# Altium schematic sheet LCD.SchDoc: LCD
size Tabloid; ApprovedBy: NA; CompanyName: Cospan Design LLC; DrawnBy: David McCoy; Engineer: David McCoy; DocumentNumber: 11; Revision: A; SheetNumber: 11; SheetTotal: 18; Client: OSH; Project: Guppy Buddy; ProjectPrettyName: Guppy Buddy
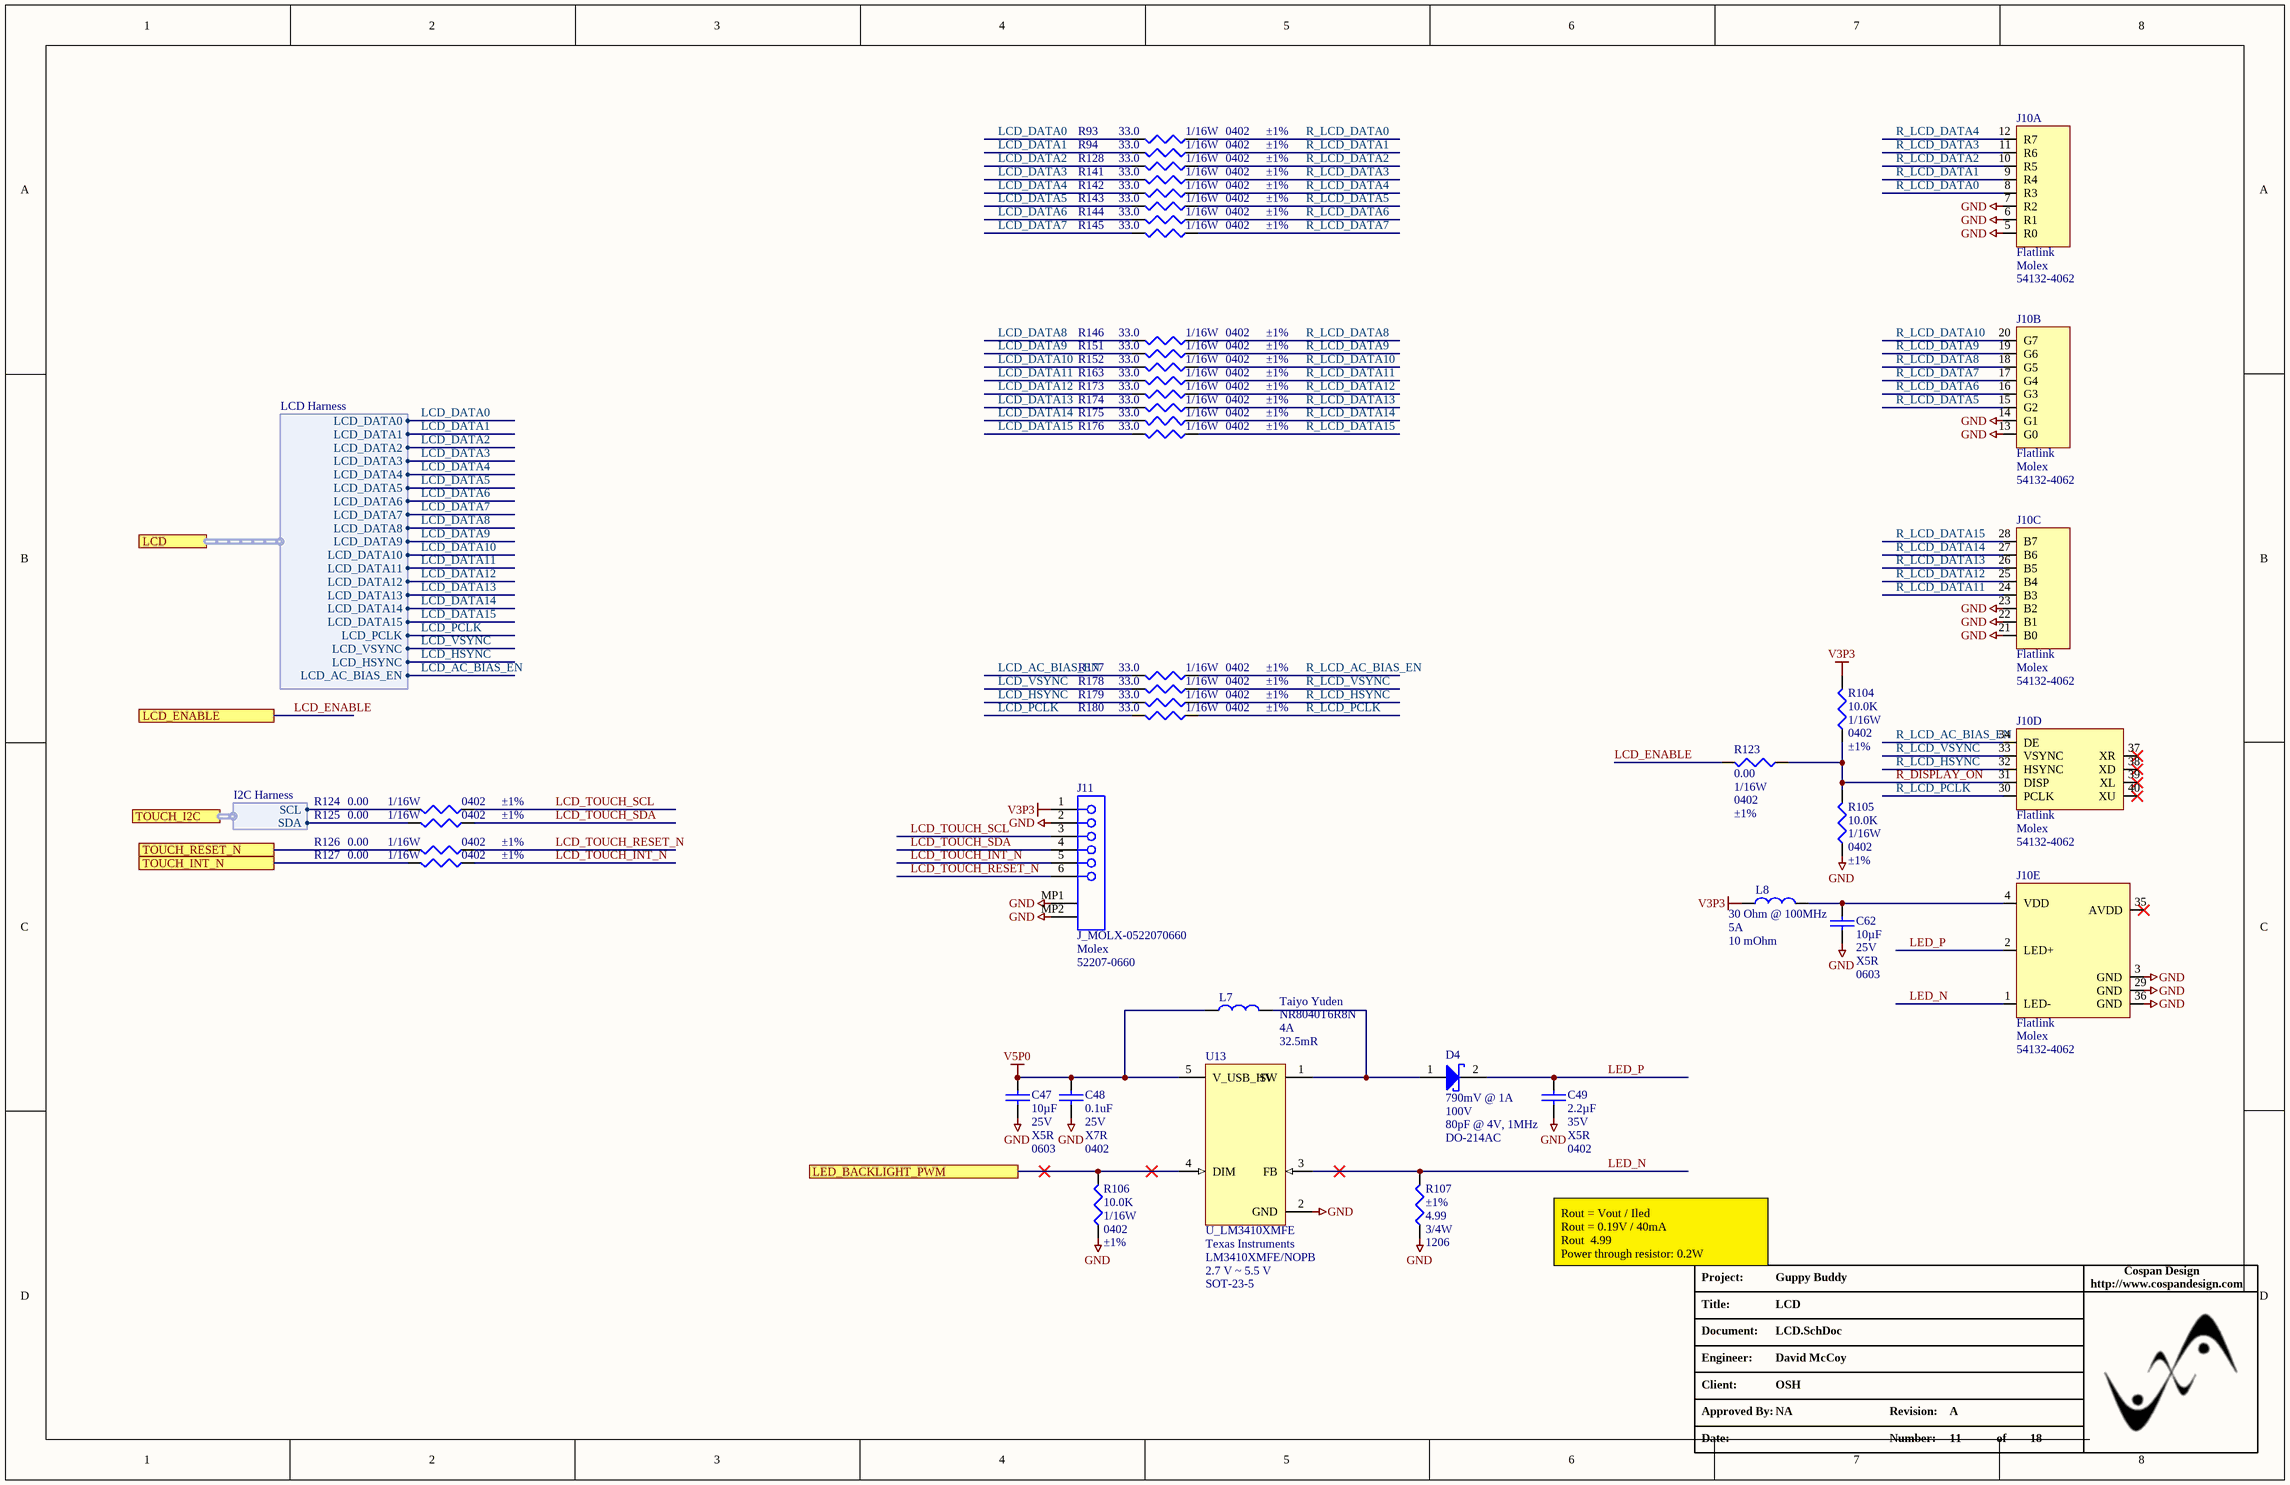
[diagram p0: LCD.SchDoc]

## Parts
C47  Capacitance: 10µF  Voltage - Rated: 25V  Temperature Coefficient: X5R  Package / Case: 0603  [C_ERA-0603]  (hidden comment: C_0603_10µF)
C48  Capacitance: 0.1uF  Voltage - Rated: 25V  Temperature Coefficient: X7R  Package / Case: 0402  [C_0402]  (hidden comment: C_0402_0.1UF_25V)
C49  Capacitance: 2.2µF  Voltage - Rated: 35V  Temperature Coefficient: X5R  Package / Case: 0402  [C_0402]  (hidden comment: C_0402_2.2uF_35V)
C62  Capacitance: 10µF  Voltage - Rated: 25V  Temperature Coefficient: X5R  Package / Case: 0603  [C_ERA-0603]  (hidden comment: C_0603_10µF)
D4  Voltage - Forward (Vf) (Max) @ If: 790mV @ 1A  Voltage - DC Reverse (Vr) (Max): 100V  Capacitance @ Vr, F: 80pF @ 4V, 1MHz  Package / Case: DO-214AC  [DIOM5226X23L]  (hidden comment: B1100-13-F)
J10  Flatlink  Manufacturer 1: Molex  Manufacturer Part Number 1: 54132-4062  [FPC_40PIN_BOTTOM]  (parts A,B,C,D,E of 5)
J11  J_MOLX-0522070660  Manufacturer 1: Molex  Manufacturer Part Number 1: 52207-0660  [MOLX-52271-0679]
L7  Manufacturer: Taiyo Yuden  Manufacturer Part Number: NR8040T6R8N  Max DC Current: 4A  DC Resistance (DCR): 32.5mR  [IND_TAIYO_NR8040]  (hidden comment: L_6.8µH_SHLD_4A)
L8  Impedance @ Frequency: 30 Ohm @ 100MHz  Current Rating (Max): 5A  DC Resistance (DCR) (Max): 10 mOhm  [R_0603]  (hidden comment: L_BEAD_0603_30OHM_100MHZ)
R93  Resistance In Ohms: 33.0  Power (Watts): 1/16W  Case: 0402  Tolerance: ±1%  [R_0402]  (hidden comment: R_0402_33)
R94  Resistance In Ohms: 33.0  Power (Watts): 1/16W  Case: 0402  Tolerance: ±1%  [R_0402]  (hidden comment: R_0402_33)
R104  Resistance In Ohms: 10.0K  Power (Watts): 1/16W  Case: 0402  Tolerance: ±1%  [R_0402]  (hidden comment: R_0402_10.0K)
R105  Resistance In Ohms: 10.0K  Power (Watts): 1/16W  Case: 0402  Tolerance: ±1%  [R_0402]  (hidden comment: R_0402_10.0K)
R106  Resistance In Ohms: 10.0K  Power (Watts): 1/16W  Case: 0402  Tolerance: ±1%  [R_0402]  (hidden comment: R_0402_10.0K)
R107  Tolerance: ±1%  Resistance In Ohms: 4.99  Power (Watts): 3/4W  Case: 1206  [R_1206]  (hidden comment: R_1206_4.99)
R123  Resistance In Ohms: 0.00  Power (Watts): 1/16W  Case: 0402  Tolerance: ±1%  [R_0402]  (hidden comment: 0.0 Ohms)
R124  Resistance In Ohms: 0.00  Power (Watts): 1/16W  Case: 0402  Tolerance: ±1%  [R_0402]  (hidden comment: 0.0 Ohms)
R125  Resistance In Ohms: 0.00  Power (Watts): 1/16W  Case: 0402  Tolerance: ±1%  [R_0402]  (hidden comment: 0.0 Ohms)
R126  Resistance In Ohms: 0.00  Power (Watts): 1/16W  Case: 0402  Tolerance: ±1%  [R_0402]  (hidden comment: 0.0 Ohms)
R127  Resistance In Ohms: 0.00  Power (Watts): 1/16W  Case: 0402  Tolerance: ±1%  [R_0402]  (hidden comment: 0.0 Ohms)
R128  Resistance In Ohms: 33.0  Power (Watts): 1/16W  Case: 0402  Tolerance: ±1%  [R_0402]  (hidden comment: R_0402_33)
R141  Resistance In Ohms: 33.0  Power (Watts): 1/16W  Case: 0402  Tolerance: ±1%  [R_0402]  (hidden comment: R_0402_33)
R142  Resistance In Ohms: 33.0  Power (Watts): 1/16W  Case: 0402  Tolerance: ±1%  [R_0402]  (hidden comment: R_0402_33)
R143  Resistance In Ohms: 33.0  Power (Watts): 1/16W  Case: 0402  Tolerance: ±1%  [R_0402]  (hidden comment: R_0402_33)
R144  Resistance In Ohms: 33.0  Power (Watts): 1/16W  Case: 0402  Tolerance: ±1%  [R_0402]  (hidden comment: R_0402_33)
R145  Resistance In Ohms: 33.0  Power (Watts): 1/16W  Case: 0402  Tolerance: ±1%  [R_0402]  (hidden comment: R_0402_33)
R146  Resistance In Ohms: 33.0  Power (Watts): 1/16W  Case: 0402  Tolerance: ±1%  [R_0402]  (hidden comment: R_0402_33)
R151  Resistance In Ohms: 33.0  Power (Watts): 1/16W  Case: 0402  Tolerance: ±1%  [R_0402]  (hidden comment: R_0402_33)
R152  Resistance In Ohms: 33.0  Power (Watts): 1/16W  Case: 0402  Tolerance: ±1%  [R_0402]  (hidden comment: R_0402_33)
R163  Resistance In Ohms: 33.0  Power (Watts): 1/16W  Case: 0402  Tolerance: ±1%  [R_0402]  (hidden comment: R_0402_33)
R173  Resistance In Ohms: 33.0  Power (Watts): 1/16W  Case: 0402  Tolerance: ±1%  [R_0402]  (hidden comment: R_0402_33)
R174  Resistance In Ohms: 33.0  Power (Watts): 1/16W  Case: 0402  Tolerance: ±1%  [R_0402]  (hidden comment: R_0402_33)
R175  Resistance In Ohms: 33.0  Power (Watts): 1/16W  Case: 0402  Tolerance: ±1%  [R_0402]  (hidden comment: R_0402_33)
R176  Resistance In Ohms: 33.0  Power (Watts): 1/16W  Case: 0402  Tolerance: ±1%  [R_0402]  (hidden comment: R_0402_33)
R177  Resistance In Ohms: 33.0  Power (Watts): 1/16W  Case: 0402  Tolerance: ±1%  [R_0402]  (hidden comment: R_0402_33)
R178  Resistance In Ohms: 33.0  Power (Watts): 1/16W  Case: 0402  Tolerance: ±1%  [R_0402]  (hidden comment: R_0402_33)
R179  Resistance In Ohms: 33.0  Power (Watts): 1/16W  Case: 0402  Tolerance: ±1%  [R_0402]  (hidden comment: R_0402_33)
R180  Resistance In Ohms: 33.0  Power (Watts): 1/16W  Case: 0402  Tolerance: ±1%  [R_0402]  (hidden comment: R_0402_33)
U13  U_LM3410XMFE  Manufacturer: Texas Instruments  Manufacturer Part Number: LM3410XMFE/NOPB  Voltage - Supply: 2.7 V ~ 5.5 V  Supplier Device Package: SOT-23-5  [MF05A_N]

## Ports
LCD (harness LCD Harness), LCD_ENABLE, LED_BACKLIGHT_PWM, TOUCH_I2C (harness I2C Harness), TOUCH_INT_N, TOUCH_RESET_N

## Harnesses
LCD Harness: LCD_DATA0, LCD_DATA1, LCD_DATA2, LCD_DATA3, LCD_DATA4, LCD_DATA5, LCD_DATA6, LCD_DATA7, LCD_DATA8, LCD_DATA9, LCD_DATA10, LCD_DATA11, LCD_DATA12, LCD_DATA13, LCD_DATA14, LCD_DATA15, LCD_PCLK, LCD_VSYNC, LCD_HSYNC, LCD_AC_BIAS_EN
I2C Harness: SCL, SDA

## Nets
GND: C47.1 C48.1 C49.1 C62.1 J10.3(GND) J10.5(R0) J10.6(R1) J10.7(R2) J10.13(G0) J10.14(G1) J10.21(B0) J10.22(B1) J10.23(B2) J10.29(GND) J10.36(GND) J11.2 J11.MP1 J11.MP2 R105.2 R106.2 R107.2 U13.2(GND)
V3P3: J11.1 L8.2 R104.1
V5P0: C47.2 C48.2 L7.1 U13.5(V_USB_HV)
LCD_AC_BIAS_EN: R177.1 ; port LCD.LCD_AC_BIAS_EN
LCD_DATA0: R93.1 ; port LCD.LCD_DATA0
LCD_DATA1: R94.1 ; port LCD.LCD_DATA1
LCD_DATA2: R128.1 ; port LCD.LCD_DATA2
LCD_DATA3: R141.1 ; port LCD.LCD_DATA3
LCD_DATA4: R142.1 ; port LCD.LCD_DATA4
LCD_DATA5: R143.1 ; port LCD.LCD_DATA5
LCD_DATA6: R144.1 ; port LCD.LCD_DATA6
LCD_DATA7: R145.1 ; port LCD.LCD_DATA7
LCD_DATA8: R146.1 ; port LCD.LCD_DATA8
LCD_DATA9: R151.1 ; port LCD.LCD_DATA9
LCD_DATA10: R152.1 ; port LCD.LCD_DATA10
LCD_DATA11: R163.1 ; port LCD.LCD_DATA11
LCD_DATA12: R173.1 ; port LCD.LCD_DATA12
LCD_DATA13: R174.1 ; port LCD.LCD_DATA13
LCD_DATA14: R175.1 ; port LCD.LCD_DATA14
LCD_DATA15: R176.1 ; port LCD.LCD_DATA15
LCD_ENABLE: R123.1 ; port LCD_ENABLE
LCD_HSYNC: R179.1 ; port LCD.LCD_HSYNC
LCD_PCLK: R180.1 ; port LCD.LCD_PCLK
LCD_TOUCH_INT_N: J11.5 R127.2
LCD_TOUCH_RESET_N: J11.6 R126.2
LCD_TOUCH_SCL: J11.3 R124.2
LCD_TOUCH_SDA: J11.4 R125.2
LCD_VSYNC: R178.1 ; port LCD.LCD_VSYNC
LED_BACKLIGHT_PWM: R106.1 U13.4(DIM) ; port LED_BACKLIGHT_PWM
LED_N: J10.1(LED-) R107.1 U13.3(FB)
LED_P: C49.2 D4.2(K) J10.2(LED+)
R_DISPLAY_ON: J10.31(DISP) R104.2 R105.1 R123.2
R_LCD_AC_BIAS_EN: J10.34(DE) R177.2
R_LCD_DATA0: J10.8(R3) R93.2
R_LCD_DATA1: J10.9(R4) R94.2
R_LCD_DATA2: J10.10(R5) R128.2
R_LCD_DATA3: J10.11(R6) R141.2
R_LCD_DATA4: J10.12(R7) R142.2
R_LCD_DATA5: J10.15(G2) R143.2
R_LCD_DATA6: J10.16(G3) R144.2
R_LCD_DATA7: J10.17(G4) R145.2
R_LCD_DATA8: J10.18(G5) R146.2
R_LCD_DATA9: J10.19(G6) R151.2
R_LCD_DATA10: J10.20(G7) R152.2
R_LCD_DATA11: J10.24(B3) R163.2
R_LCD_DATA12: J10.25(B4) R173.2
R_LCD_DATA13: J10.26(B5) R174.2
R_LCD_DATA14: J10.27(B6) R175.2
R_LCD_DATA15: J10.28(B7) R176.2
R_LCD_HSYNC: J10.32(HSYNC) R179.2
R_LCD_PCLK: J10.30(PCLK) R180.2
R_LCD_VSYNC: J10.33(VSYNC) R178.2
TOUCH_INT_N: R127.1 ; port TOUCH_INT_N
TOUCH_RESET_N: R126.1 ; port TOUCH_RESET_N
NetC62_2: C62.2 J10.4(VDD) L8.1
NetD4_1: D4.1(A) L7.2 U13.1(SW)
NetR124_1: R124.1 ; port TOUCH_I2C.SCL
NetR125_1: R125.1 ; port TOUCH_I2C.SDA

Not connected (* = marked no-connect by the designer): J10 35(AVDD)* 37(XR)* 38(XD)* 39(XL)* 40(XU)*

## Notes on the sheet
- Rout = Vout / Iled
  Rout = 0.19V / 40mA
  Rout  4.99
  Power through resistor: 0.2W
- Project:
- http://www.cospandesign.com
- Cospan Design
- Document:
- Engineer:
- Title:
- Client:
- Approved By:
- Revision:
- Date:
- Number:
- of

## Library data of the parts
C47 C62 = C_0603_10µF: CAP CER 10UF 16V X5R 0603; Manufacturer: Murata Electronics North America; Manufacturer Part Number: GRM188R61C106MA73D; Tolerance: ±20%; Supplier 1: Digi-Key; RoHS: RoHS Compliant; Category: Capacitors; Stock 1: 450536; Pricing 1: 1=0.35, 10=0.303, 50=0.184, 100=0.1516, 250=0.12124, 500=0.11042, 1000=0.09959 (USD); Packaging: Cut Tape (CT); Mounting Type: Surface Mount, MLCC; Operating Temperature: -55°C ~ 85°C; Applications: General Purpose; Ratings: -; Size / Dimension: 0.063" L x 0.031" W (1.60mm x 0.80mm); Height - Seated (Max): -; Thickness (Max): 0.031" (0.80mm); Lead Spacing: -; Features: -; Lead Style: -; ComponentLink1URL: http://www.murata.com/~/media/webrenewal/support/library/catalog/products/capacitor/mlcc/c02e.pdf; ComponentLink1Description: http://www.murata.com/~/media/webrenewal/support/library/catalog/products/capacitor/mlcc/c02e.pdf; Supplier Part Number 1: 490-7201-1-ND
C48 = C_0402_0.1UF_25V: CAP CER 0.1UF 25V X6S 0402; Manufacturer 1: Yageo; Manufacturer Part Number 1: CC0402KRX7R8BB104; Description 1: Cap Ceramic 0.1uF 25V X7R 10% SMD 0402 125C Paper T/R; Tolerance: 10%; Dissipation Factor: 3.5%; ComponentLink1URL: https://product.tdk.com/info/en/catalog/datasheets/mlcc_commercial_general_en.pdf; ComponentLink1Description: https://product.tdk.com/info/en/catalog/datasheets/mlcc_commercial_general_en.pdf; Supplier 1: Digi-Key; Supplier Part Number 1: 311-2077-1-ND; Stock 1: 0; Pricing 1: 1=0.1, 10=0.048, 100=0.0215, 500=0.01534, 1000=0.01205, 2500=0.01095, 5000=0.01007 (USD); Mount: Surface Mount; Case/Package: 0402; Case Code (Imperial): 0402; Case Code (Metric): 1005; Min Operating Temperature: -55°C; Max Operating Temperature: 125°C; Voltage Rating: 25V; Voltage Rating (DC): 25V; Packaging: Tape and Reel; Dielectric: X7R; Termination: SMD/SMT; Composition: Ceramic; Length: 1mm; Height: 0.5mm; Width: 0.02inch; Thickness: 0.022inch; Depth: 0.5mm; Radiation Hardening: No; Lead Free: Lead Free; Halogen Free: Halogen Free; ComponentLink2URL: https://datasheet.ciiva.com/11464/upy-gphc-x7r-6-3v-to-50v-8-11464889.pdf; ComponentLink2Description: https://datasheet.ciiva.com/11464/upy-gphc-x7r-6-3v-to-50v-8-11464889.pdf; ComponentLink3URL: https://datasheet.ciiva.com/13210/upy-gphc-x7r-6-3v-to-50v-8-12304-13210908.pdf; ComponentLink3Description: https://datasheet.ciiva.com/13210/upy-gphc-x7r-6-3v-to-50v-8-12304-13210908.pdf; ComponentLink4URL: https://datasheet.ciiva.com/17437/upy-gphc-x7r-6-3v-to-50v-8-17437357.pdf; ComponentLink4Description: https://datasheet.ciiva.com/17437/upy-gphc-x7r-6-3v-to-50v-8-17437357.pdf
C49 = C_0402_2.2uF_35V: CAP CER 2.2UF 35V 20% X5R 0402; Manufacturer: TDK Corporation; Manufacturer Part Number: C1005X5R1V225K050BC; Tolerance: ±10%; Supplier 1: Digi-Key; Supplier Part Number 1: 445-9028-1-ND; RoHS: RoHS Compliant; Category: Capacitors; Stock 1: 300469; Packaging: Cut Tape (CT); Mounting Type: Surface Mount, MLCC; Operating Temperature: -55°C ~ 85°C; Applications: General Purpose; Ratings: -; Size / Dimension: 0.039" L x 0.020" W (1.00mm x 0.50mm); Height - Seated (Max): -; Thickness (Max): 0.022" (0.55mm); Lead Spacing: -; Features: Low ESL; Lead Style: -; ComponentLink1URL: https://product.tdk.com/info/en/catalog/datasheets/mlcc_commercial_general_en.pdf; ComponentLink1Description: https://product.tdk.com/info/en/catalog/datasheets/mlcc_commercial_general_en.pdf; Pricing 1: 1=0.36, 10=0.253, 100=0.1518, 500=0.11386, 1000=0.09614, 2500=0.09108, 5000=0.08602 (USD); Part Status: Active; Failure Rate: -
D4 = D_SCHOTT_B1100-13-F: DIODE SCHOTTKY 100V 1A SMA; Manufacturer: Diodes Inc; Speed: Fast Recovery =< 500ns, > 200mA (Io); Current - Reverse Leakage @ Vr: 500µA @ 100V; Supplier 1: Digi-Key; Supplier Part Number 1: B1100-FDICT-ND; Manufacturer Part Number: B1100-13-F; RoHS: RoHS Compliant; Category: Discrete Semiconductor Products; Stock 1: 109264; Pricing: 1=0.57, 10=0.4, 25=0.3288, 100=0.2627, 250=0.1914, 500=0.15544, 1000=0.11948, 2500=0.1073 (USD); Diode Type: Schottky; Current - Average Rectified (Io): 1A; Reverse Recovery Time (trr): -; Mounting Type: Surface Mount; Supplier Device Package: SMA; Packaging: Cut Tape (CT); ComponentLink1URL: http://www.diodes.com/datasheets/ds30018.pdf; ComponentLink1Description: http://www.diodes.com/datasheets/ds30018.pdf; COST_1: *; COST_100: *; COST_1000: *; MANF1: *; MANF1_PN: *; MANF2: *; MANF2_PN: *; MANF3: *; MANF3_PN: *; VENDOR1: *; VENDOR1_PN: *
J10 = J_FPC_MOLEX_40POS: CONN FFC/FPC .50MM 40POS R/A SMD; Description 1: FFC & FPC Connectors 0.5 FPC Hsg AssyBtmW /AuPlt40CktEmbsTpPkg; Contact Resistance: 20mR; Current Rating: 500mA; Voltage Rating: 50V; Number of Positions: 40; Gender: Female; Mating Cycles: 20; Contact Location: Bottom; Stackable: No; Pitch: 0.5mm; ComponentLink1URL: http://www.molex.com/pdm_docs/sd/541324097_sd.pdf; ComponentLink1Description: http://www.molex.com/pdm_docs/sd/541324097_sd.pdf; Stock 1: 18264; Contact Material: Bronze; Contact Plating: Nickel,Gold; Housing Material: Thermoplastic; Colour: Black; Material: Bronze; Min Operating Temperature: -20°C; Max Operating Temperature: 85°C; Package Quantity: 1500; Number of Rows: 1; Packaging: Tape and Reel; Termination: Solder; Number of Contacts: 40; Orientation: Right Angle; Number of Circuits: 40; Radiation Hardening: No; Flammability Rating: UL94 V-0; REACH SVHC: No SVHC; ELV: Compliant; Lead Free: Lead Free; ComponentLink2URL: https://datasheet.ciiva.com/10366/0541324062-ffc-fpc-connectors-10366848.pdf; ComponentLink2Description: https://datasheet.ciiva.com/10366/0541324062-ffc-fpc-connectors-10366848.pdf; ComponentLink3URL: https://datasheet.ciiva.com/5136/0541324062-ffc-fpc-connectors-143955-5136808.pdf; ComponentLink3Description: https://datasheet.ciiva.com/5136/0541324062-ffc-fpc-connectors-143955-5136808.pdf; ComponentLink4URL: https://datasheet.ciiva.com/11745/0900766b80d5d226-11745087.pdf; ComponentLink4Description: https://datasheet.ciiva.com/11745/0900766b80d5d226-11745087.pdf; Supplier 1: Digi-Key; Supplier Part Number 1: WM3436DKR-ND; Pricing 1: 1=2.05, 10=1.861, 25=1.7472, 50=1.6712, 100=1.5953, 250=1.44336, 500=1.3294 (USD)
J11 = J_MOLX-0522070660: CONN FFC FPC TOP 6POS 1.00MM R/A; Description 1: CONNECTOR, FPC, 1.0MM, 6WAY; Contact Resistance: 20mR; Current Rating: 1A; Voltage Rating: 125V; Number of Positions: 6; Gender: Receptacle; Stackable: No; Pitch: 1mm; ComponentLink1URL: http://www.molex.com/pdm_docs/sd/522710479_sd.pdf; ComponentLink1Description: http://www.molex.com/pdm_docs/sd/522710479_sd.pdf; Stock 1: 5020; Contact Plating: Nickel,Gold; Contact Material: Bronze; Housing Colour: Natural; Housing Material: Nylon; Material: Bronze; Min Operating Temperature: -30°C; Max Operating Temperature: 85°C; Number of Rows: 1; Package Quantity: 1000; Packaging: Tape and Reel; Termination: SMD/SMT; Orientation: Right Angle; Number of Contacts: 6; Number of Circuits: 6; Length: 13.9mm; Depth: 8.9mm; Flammability Rating: UL94 V-0; REACH SVHC: Unknown; ELV: Compliant; ComponentLink2URL: https://datasheet.ciiva.com/16658/0522070660-ffc-fpc-connectors-16658853.pdf; ComponentLink2Description: https://datasheet.ciiva.com/16658/0522070660-ffc-fpc-connectors-16658853.pdf; ComponentLink3URL: https://datasheet.ciiva.com/1438/522071060-sd-1438423.pdf; ComponentLink3Description: https://datasheet.ciiva.com/1438/522071060-sd-1438423.pdf; ComponentLink4URL: https://datasheet.ciiva.com/26929/getdatasheetpartid-761355-26929848.pdf; ComponentLink4Description: https://datasheet.ciiva.com/26929/getdatasheetpartid-761355-26929848.pdf; ComponentLink5URL: https://datasheet.ciiva.com/5137/0522070660-ffc-fpc-connectors-149417-5137997.pdf; ComponentLink5Description: https://datasheet.ciiva.com/5137/0522070660-ffc-fpc-connectors-149417-5137997.pdf; ComponentLink6URL: https://datasheet.ciiva.com/11745/0900766b80d6d4e7-11745263.pdf; ComponentLink6Description: https://datasheet.ciiva.com/11745/0900766b80d6d4e7-11745263.pdf; Pricing 1: 1=0.94, 10=0.828, 25=0.7796, 50=0.7472, 100=0.7146, 250=0.64968, 500=0.5847 (USD); Supplier 1: Digi-Key; Supplier Part Number 1: WM10939DKR-ND
L7 = L_6.8µH_SHLD_4A: FIXED IND 6.8UH 3.7A 32.5 MOHM; Inductance: 6.8µH; Core Material: Ferrite; Self Resonant Frequency: 24MHz; Tolerance: 30%; Shielding: Shielded; Test Frequency: 100KHz; Supplier 1: Digikey; Stock 1: 11407; Pricing 1: 1=0.53, 10=0.46, 100=0.3283, 500=0.2758 (USD); Case/Package: Nonstandard; Number of Pins: 2; Min Operating Temperature: -25°C; Max Operating Temperature: 120°C; Packaging: Tape and Reel; Package Quantity: 1000; Current Rating: 3.7A; Saturation Current: 4A; Termination: SMD/SMT; Composition: Wirewound; Length: 0.315inch; Height: 4mm; Width: 8mm; Height - Seated (Max): 0.157inch; Depth: 8.2mm; Radiation Hardening: No; Lead Free: Lead Free; Halogen Free: Halogen Free; ComponentLink1URL: https://datasheet.ciiva.com/23806/1750159-23806706.pdf; ComponentLink1Description: https://datasheet.ciiva.com/23806/1750159-23806706.pdf; ComponentLink2URL: https://datasheet.ciiva.com/8502/nr8040t6r8n-ss-8502742.pdf; ComponentLink2Description: https://datasheet.ciiva.com/8502/nr8040t6r8n-ss-8502742.pdf; ComponentLink3URL: https://datasheet.ciiva.com/1045/wound04-e-1045225.pdf; ComponentLink3Description: https://datasheet.ciiva.com/1045/wound04-e-1045225.pdf; ComponentLink4URL: https://datasheet.ciiva.com/1045/wound04-e-1045226.pdf; ComponentLink4Description: https://datasheet.ciiva.com/1045/wound04-e-1045226.pdf; ComponentLink5URL: https://datasheet.ciiva.com/1045/wound04-e-1045227.pdf; ComponentLink5Description: https://datasheet.ciiva.com/1045/wound04-e-1045227.pdf; Supplier Part Number 1: 587-2000-6-ND
L8 = L_BEAD_0603_30OHM_100MHZ: FERRITE BEAD 30 OHM 0603; Manufacturer: TDK Corporation; Manufacturer Part Number: MPZ1608S300ATAH0; Filter Type: Power Line; Number of Lines: 1; Supplier 1: Digi-Key; RoHS: RoHS Compliant; Category: Filters; Stock 1: 25799; Pricing 1: 1=0.1, 10=0.079, 100=0.0472, 250=0.03432, 500=0.03146, 1000=0.02717 (USD); Packaging: Cut Tape (CT); Ratings: -; Operating Temperature: -55°C ~ 125°C; Package / Case: 0603 (1608 Metric); Mounting Type: Surface Mount; Height (Max): 0.030" (0.75mm); Size / Dimension: 0.063" L x 0.031" W (1.60mm x 0.80mm); ComponentLink1URL: https://product.tdk.com/info/en/catalog/datasheets/beads_commercial_power_mpz1608_en.pdf; ComponentLink1Description: https://product.tdk.com/info/en/catalog/datasheets/beads_commercial_power_mpz1608_en.pdf; Supplier Part Number 1: 445-1562-1-ND
R93 R94 R128 R141-R146 R151 R152 R163 R173-R180 = R_0402_33: RES 33.0 OHM 1/16W 1% 0402 SMD; Manufacturer: Yageo; Manufacturer Part Number: RC0402FR-0733RL; Resistance (Ohms): 33; Temperature Coefficient: ±100ppm/°C; Supplier 1: Digi-Key; Supplier Part Number 1: 311-33.0LRCT-ND; RoHS: RoHS Compliant; Category: Resistors; Stock 1: 733920; Pricing: 10=0.014, 50=0.0104, 100=0.0079, 250=0.00584, 500=0.00432, 1000=0.00288 (USD); Composition: Thick Film; Features: -; Size / Dimension: 0.039" L x 0.020" W (1.00mm x 0.50mm); Height: 0.014" (0.35mm); Number of Terminations: 2; Packaging: Cut Tape (CT); Package / Case: 0402 (1005 Metric); ComponentLink1URL: http://www.yageo.com/documents/recent/PYu-RC0402_51_RoHS_L_6.pdf; ComponentLink1Description: http://www.yageo.com/documents/recent/PYu-RC0402_51_RoHS_L_6.pdf
R104-R106 = R_0402_10.0K: RES 10.0K OHM 1/16W 1% 0402 SMD; Manufacturer: Stackpole Electronics Inc; Manufacturer Part Number: RMCF0402FT10K0; Resistance (Ohms): 10k; Temperature Coefficient: ±100ppm/°C; Supplier 1: Digi-Key; Supplier Part Number 1: RMCF0402FT10K0CT-ND; RoHS: RoHS Compliant; Category: Resistors; Stock 1: 234525; Pricing: 1=0.04, 10=0.025, 50=0.0138, 100=0.0105, 250=0.0078, 500=0.00576, 1000=0.00384, 2500=0.00324, 5000=0.0027 (USD); Composition: Thick Film; Features: -; Package / Case: 0402 (1005 Metric); Size / Dimension: 0.039" L x 0.020" W (1.00mm x 0.50mm); Height: 0.016" (0.40mm); Number of Terminations: 2; Packaging: Cut Tape (CT); ComponentLink1URL: http://www.seielect.com/Catalog/SEI-RMCF_RMCP.pdf; ComponentLink1Description: http://www.seielect.com/Catalog/SEI-RMCF_RMCP.pdf
R107 = R_1206_4.99: RES SMD 4.99 OHM 1% 3/4W 1206; Manufacturer: Vishay / Dale; Manufacturer Part Number: CRCW12064R99FKEAHP; Max Power Dissipation: 500mW; Temperature Coefficient: 100ppm/°C; Resistance: 4.99R; Supplier 1: Digikey; Stock 1: 24650; Pricing 1: 1=0.49, 10=0.375, 100=0.1577, 1000=0.087, 2500=0.0816 (USD); Case/Package: 1206; Case Code (Metric): 3216; Case Code (Imperial): 1206; Contact Plating: Tin; Min Operating Temperature: -55°C; Max Operating Temperature: 155°C; Packaging: Tape and Reel; Composition: Thick Film; Number of Terminations: 2; Length: 0.122inch; Height: 0.026inch; Width: 0.063inch; Lead Free: Lead Free; ComponentLink1URL: http://www.vishay.com/docs/20043/crcwhpe3.pdf; ComponentLink1Description: http://www.vishay.com/docs/20043/crcwhpe3.pdf; Supplier Part Number 1: 541-4.99UDKR-ND
R123-R127 = R_0402_0.00: RES 0.00 OHM 1/16W 1% 0402 SMD; Manufacturer: Yageo; Manufacturer Part Number: RC0402JR-070RL; Supplier 1: Digi-Key; RoHS: RoHS Compliant; Category: Resistors; Stock 1: 14041464; Pricing 1: 1=0.1, 10=0.01, 25=0.0068, 50=0.0052, 100=0.0038, 250=0.00288, 500=0.0023, 1000=0.0017, 5000=0.00122 (USD); Packaging: Cut Tape (CT); Part Status: Active; Composition: Thick Film; Features: Moisture Resistant; Temperature Coefficient: -; Operating Temperature: -55°C ~ 155°C; Package / Case: 0402 (1005 Metric); Supplier Device Package: 0402; Size / Dimension: 0.039" L x 0.020" W (1.00mm x 0.50mm); Height - Seated (Max): 0.016" (0.40mm); Failure Rate: -; ComponentLink1URL: http://www.yageo.com/documents/recent/PYu-RC_Group_51_RoHS_L_7.pdf; ComponentLink1Description: http://www.yageo.com/documents/recent/PYu-RC_Group_51_RoHS_L_7.pdf; Supplier Part Number 1: 311-0.0JRCT-ND
U13 = U_LM3410XMFE: IC DRVR WT/OLED BCKLT SOT23-5; Constant Current: Yes; Topology: PWM, SEPIC, Step-Up (Boost); Number of Outputs: 1; Type - Primary: Automotive, Backlight, Flash/Torch; Type - Secondary: High Brightness LED (HBLED), OLED, White LED; Frequency: 1.2MHz ~ 2MHz; Voltage - Output: 3 V ~ 24 V; Supplier 1: Digi-Key; Supplier Part Number 1: LM3410XMFE/NOPBCT-ND; RoHS: RoHS Compliant; Category: Integrated Circuits (ICs); Stock 1: 405; Pricing: 1=2.98, 10=2.67, 25=2.4012, 100=2.1839 (USD); Packaging: Cut Tape (CT); Constant Voltage: -; Internal Driver: Yes; Mounting Type: Surface Mount; Package / Case: SC-74A, SOT-753; Operating Temperature: -40°C ~ 125°C; ComponentLink1URL: http://www.ti.com/lit/ds/symlink/lm3410.pdf; ComponentLink1Description: http://www.ti.com/lit/ds/symlink/lm3410.pdf